# EAGLE design joysticks_right (EAGLE 6.4)
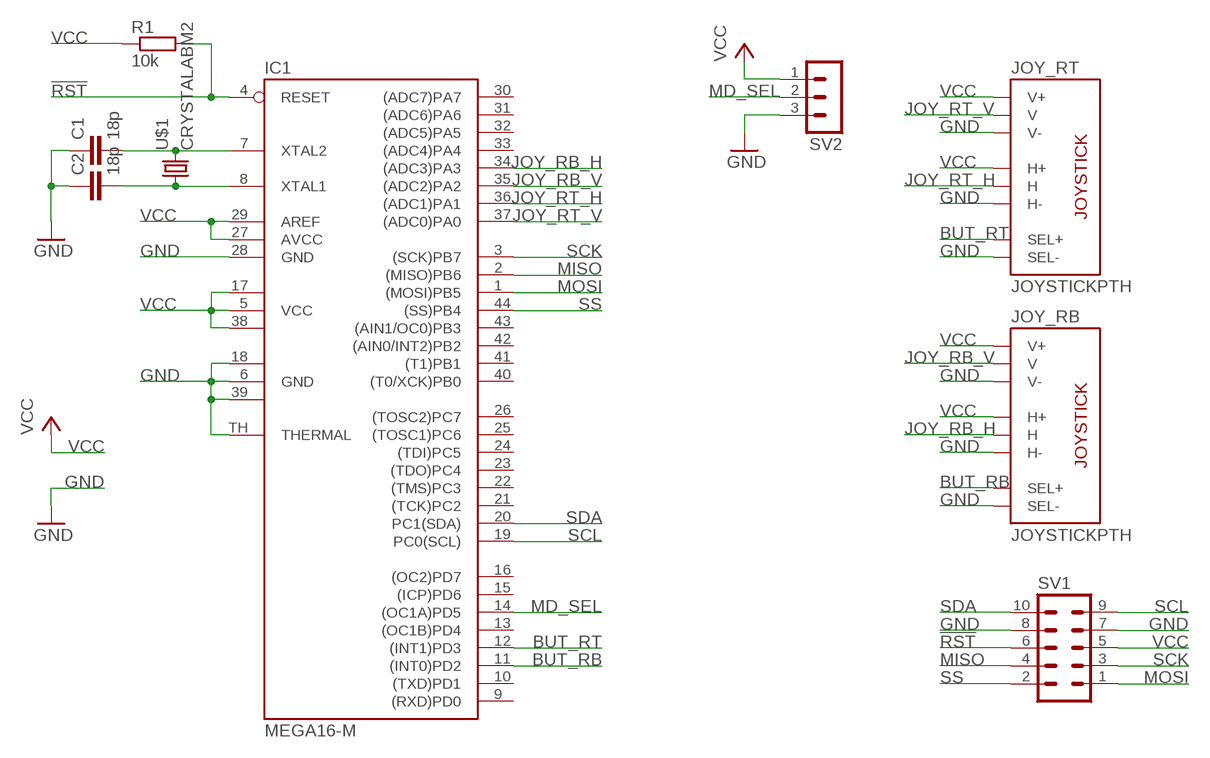
[diagram p0: schematic, sheet 1]

## Parts
C1  18p  C-EUC0603  [C0603]
C2  18p  C-EUC0603  [C0603]
IC1  MEGA16-M  [MLF44-TH]
JOY_RB  JOYSTICKPTH  [JOYSTICK]
JOY_RT  JOYSTICKPTH  [JOYSTICK]
R1  10k  R-EU_R0603  [R0603]
SV1  MA05-2  [MA05-2]
SV2  MA03-1  [MA03-1]
U$1  CRYSTALABM2  [ABM2]

## Nets
!RST: IC1.4(RESET) R1.2 SV1.6
BUT_RB: IC1.11((INT0)PD2) JOY_RB.B1A(SEL+)
BUT_RT: IC1.12((INT1)PD3) JOY_RT.B1A(SEL+)
GND: C1.1 C2.1 IC1.6(GND) IC1.18(GND1) IC1.28(GND) IC1.39(GND2) IC1.TH(THERMAL) JOY_RB.B2A(SEL-) JOY_RB.H3(H-) JOY_RB.V3(V-) JOY_RT.B2A(SEL-) JOY_RT.H3(H-) JOY_RT.V3(V-) SV1.7 SV1.8 SV2.3
JOY_RB_H: IC1.34((ADC3)PA3) JOY_RB.H2(H)
JOY_RB_V: IC1.35((ADC2)PA2) JOY_RB.V2(V)
JOY_RT_H: IC1.36((ADC1)PA1) JOY_RT.H2(H)
JOY_RT_V: IC1.37((ADC0)PA0) JOY_RT.V2(V)
MD_SEL: IC1.14((OC1A)PD5) SV2.2
MISO: IC1.2((MISO)PB6) SV1.4
MOSI: IC1.1((MOSI)PB5) SV1.1
N$1: C1.2 IC1.7(XTAL2) U$1.P$2
N$2: C2.2 IC1.8(XTAL1) U$1.P$1
SCK: IC1.3((SCK)PB7) SV1.3
SCL: IC1.19(PC0(SCL)) SV1.9
SDA: IC1.20(PC1(SDA)) SV1.10
SS: IC1.44((SS)PB4) SV1.2
VCC: IC1.5(VCC) IC1.17(VCC1) IC1.27(AVCC) IC1.29(AREF) IC1.38(VCC2) JOY_RB.H1(H+) JOY_RB.V1(V+) JOY_RT.H1(H+) JOY_RT.V1(V+) R1.1 SV1.5 SV2.1
Unconnected: IC1.9((RXD)PD0) IC1.10((TXD)PD1) IC1.13((OC1B)PD4) IC1.15((ICP)PD6) IC1.16((OC2)PD7) IC1.21((TCK)PC2) IC1.22((TMS)PC3) IC1.23((TDO)PC4) IC1.24((TDI)PC5) IC1.25((TOSC1)PC6) IC1.26((TOSC2)PC7) IC1.30((ADC7)PA7) IC1.31((ADC6)PA6) IC1.32((ADC5)PA5) IC1.33((ADC4)PA4) IC1.40((T0/XCK)PB0) IC1.41((T1)PB1) IC1.42((AIN0/INT2)PB2) IC1.43((AIN1/OC0)PB3)

## Library data of the parts
C1 C2 = rcl:C-EU: CAPACITOR, European symbol
IC1 = atmel:MEGA16-M: MICROCONTROLLER 16 Kbytes FLASH 1 kbytes SRAM 512 bytes EEPROM USART 8-channel 10 bit ADC Source: avr.lbr; MPN: ATMEGA16-16MU; OC_FARNELL: 1455097; OC_NEWARK: 58M3723
JOY_RB JOY_RT = SparkFun-Electromechanical:JOYSTICK: Thumb Joystick Joystick commonly found in PS2 controllers. Two pots and a select switch. Footprint proven. Spark Fun Electronics SKU : COM-09032
R1 = rcl:R-EU_: RESISTOR, European symbol
SV1 = con-lstb:MA05-2: PIN HEADER; OC_FARNELL: unknown; OC_NEWARK: unknown
SV2 = con-lstb:MA03-1: PIN HEADER; OC_FARNELL: unknown; OC_NEWARK: unknown
U$1 = jocki:CRYSTAL

## Board
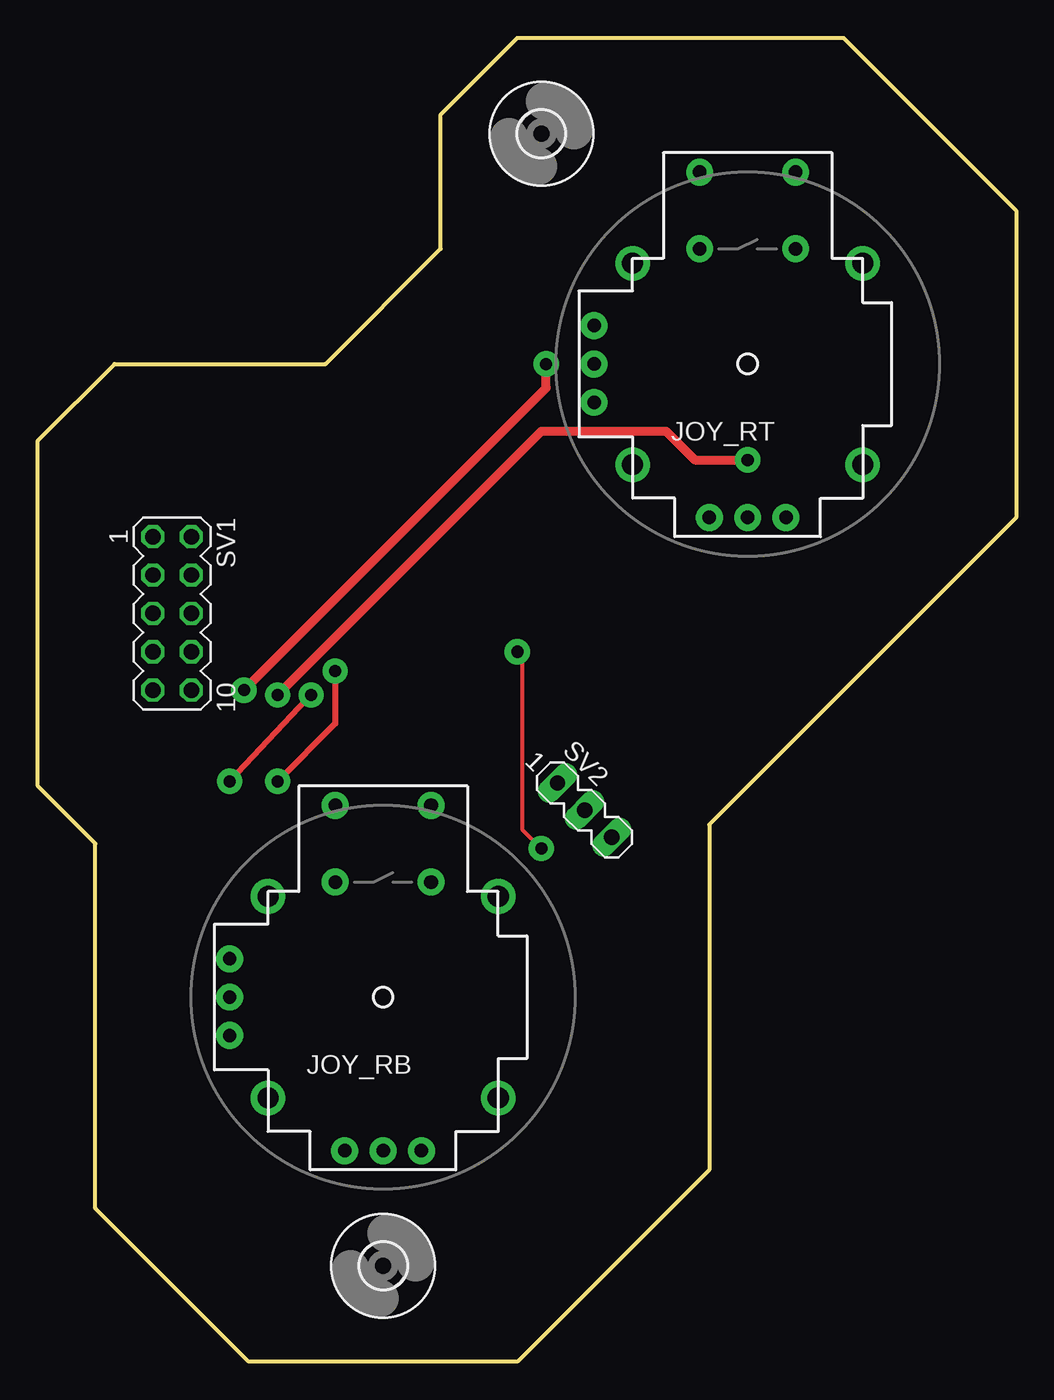
[diagram p1: board, top side]
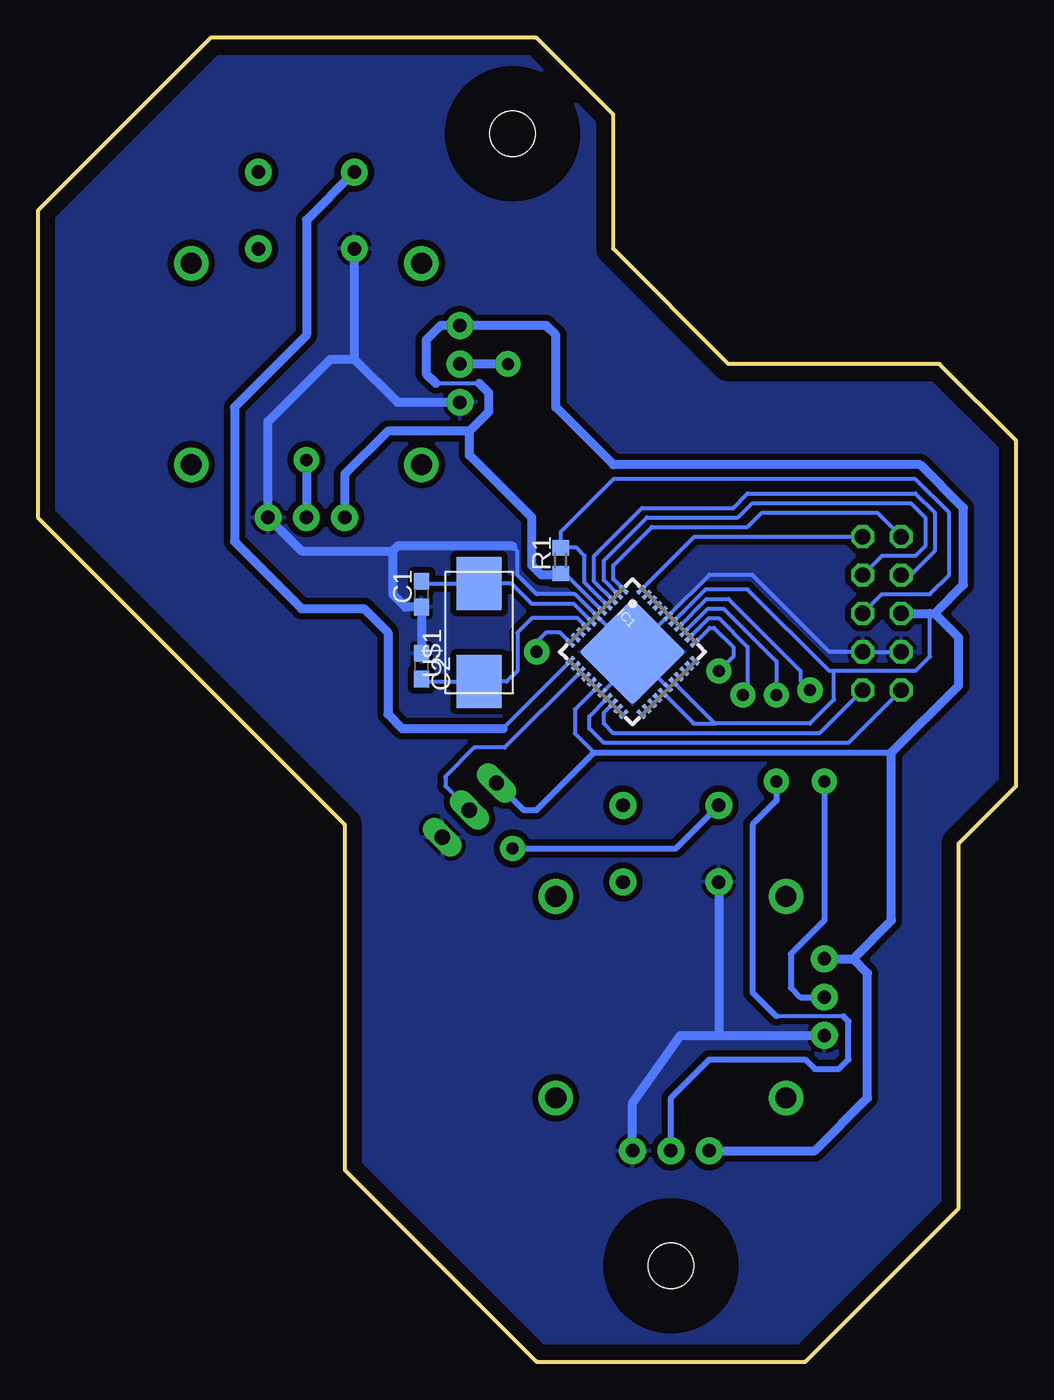
[diagram p2: board, bottom side, seen from below]

Size 64.77 x 87.63 mm. Coordinates in mm from the lower left corner, seen from the top.
Outline: 53.34,87.63 64.77,76.2 64.77,55.88 44.45,35.56 44.45,12.7 31.75,0 13.97,0 3.81,10.16 3.81,34.29 0,38.1 0,60.96 5.08,66.04 19.05,66.04 26.67,73.66 26.67,82.55 31.75,87.63 53.34,87.63
Copper layers (1*16): Top 0.035mm / dielectric 1.5mm / Bottom 0.035mm
Design rules "default": minimum track width 10mil, minimum drill 24mil, track to track 8mil, track to pad 8mil, pad to pad 8mil, via to via 8mil, smd to smd 8mil, copper to edge 40mil, drill to drill 8mil, minimum pad ring 10mil, minimum via ring 8mil, stop-mask expansion 4mil, vias tented up to drill 0mil, thermal gap 10mil

### Footprints (pad centres in the part's own frame; a part is rotated, then mirrored left to right if it is on the bottom)
C0603 = smd 1.1 x 1: 1 -0.85,0; 2 0.85,0
MLF44-TH = smd 0.7 x 0.3: 1 -3.325,2.5; 2 -3.325,2; 3 -3.325,1.5; 4 -3.325,1; 5 -3.325,0.5; 6 -3.325,0; 7 -3.325,-0.5; 8 -3.325,-1; 9 -3.325,-1.5; 10 -3.325,-2; 11 -3.325,-2.5; 23 3.325,-2.5; 24 3.325,-2; 25 3.325,-1.5; 26 3.325,-1; 27 3.325,-0.5; 28 3.325,0; 29 3.325,0.5; 30 3.325,1; 31 3.325,1.5; 32 3.325,2; 33 3.325,2.5 | smd 0.3 x 0.7: 12 -2.5,-3.325; 13 -2,-3.325; 14 -1.5,-3.325; 15 -1,-3.325; 16 -0.5,-3.325; 17 0,-3.325; 18 0.5,-3.325; 19 1,-3.325; 20 1.5,-3.325; 21 2,-3.325; 22 2.5,-3.325; 34 2.5,3.325; 35 2,3.325; 36 1.5,3.325; 37 1,3.325; 38 0.5,3.325; 39 0,3.325; 40 -0.5,3.325; 41 -1,3.325; 42 -1.5,3.325; 43 -2,3.325; 44 -2.5,3.325 | smd 5 x 5: TH 0,0
JOYSTICK = drill 0.9 pad 1.778: B1A -3.175,12.7; B1B 3.175,12.7; B2A -3.175,7.62; B2B 3.175,7.62 | drill 0.889 pad 1.778: H1 -2.54,-10.16; H2 0,-10.16; H3 2.54,-10.16; V1 -10.16,2.54; V2 -10.16,0; V3 -10.16,-2.54 | drill 1.397 pad 2.286: MOUNT1 -7.62,6.668; MOUNT2 -7.62,-6.668; MOUNT3 7.62,-6.668; MOUNT4 7.62,6.668
R0603 = smd 1 x 1.1: 1 -0.85,0; 2 0.85,0
MA05-2 = drill 1.016 octagon: 1 -5.08,-1.27; 2 -5.08,1.27; 3 -2.54,-1.27; 4 -2.54,1.27; 5 0,-1.27; 6 0,1.27; 7 2.54,-1.27; 8 2.54,1.27; 9 5.08,-1.27; 10 5.08,1.27
MA03-1 = drill 1.016 long: 1 -2.54,0; 2 0,0; 3 2.54,0
ABM2 = smd 3.5 x 3: P$1 -3.25,0; P$2 3.25,0
3,0 = hole 3: 0,0

### Placement (x,y rotation side)
C1  39.37,50.8 90 bottom
C2  39.37,46.04 270 bottom
IC1  25.4,46.99 315 bottom
JOY_RB  22.86,24.13 0 top
JOY_RT  46.99,66.04 0 top
R1  30.16,53.02 90 bottom
SV1  8.89,49.53 270 top
SV2  36.2,36.51 315 top
U$1  35.56,48.26 90 bottom
U$2  [3,0]  22.86,6.35 0 top
U$3  [3,0]  33.34,81.28 0 top

### Tracks (layer width: path | path; a pad name or v marks a point on that pad's centre or on a via)
!RST
  Bottom 0.254: IC1.4 28.57,51.58 28.57,53.34 29.11,53.87 R1.2 30.16,54.93 26.67,58.42 6.67,58.42 4.45,56.2 4.45,52.07 5.71,50.8 8.89,50.8 SV1.6
BUT_RB  (via drill 0.8 pad 1.68)
  Top 0.254: v31.75,46.99 32.07,46.67 32.07,35.24 v33.34,33.97
  Bottom 0.254: IC1.11 30.21,48.26 31.11,48.26 31.75,47.62 v31.75,46.99
  Bottom 0.406: v33.34,33.97 22.54,33.97 JOY_RB.B1A
BUT_RT
  Bottom 0.254: 33.97,41.91 29.52,46.36 IC1.12
  Bottom 0.61: JOY_RT.B1A 46.99,75.56 46.99,67.95 51.75,63.18 51.75,54.29 47.31,49.85 43.18,49.85 41.59,48.26 41.59,42.86 40.64,41.91 33.97,41.91
GND
  Bottom 0.254: IC1.6 29.21,50.8 31.75,50.8 33.02,52.07 33.02,53.66 33.34,53.98 | SV1.7 SV1.8 12.38,46.99 17.46,52.07 20.32,52.07 IC1.39 IC1.TH | IC1.6 | IC1.6 IC1.TH | IC1.28 | IC1.28 IC1.TH | IC1.18 25.4,46.28 IC1.TH
  Bottom 0.61: C2.1 C1.1 40.43,49.95 41.28,50.8 41.28,53.66 | 33.34,53.98 40.96,53.98 41.28,53.66 | JOY_RT.B2A 43.82,66.36 | 43.82,66.36 40.96,63.5 JOY_RT.V3 | 43.82,66.36 45.4,66.36 49.53,62.23 JOY_RT.H3 47.31,53.66 41.28,53.66 | JOY_RB.H3 25.4,17.14 22.22,21.59 19.68,21.59 | 19.68,21.59 JOY_RB.V3 | JOY_RB.B2A 19.68,21.59
  pour Bottom (isolate 0.406): 0,60.96 0,38.1 3.81,34.29 3.81,10.16 13.97,0 31.75,0 44.45,12.7 44.45,35.56 64.77,55.88 64.77,76.2 53.34,87.63 31.75,87.63 26.67,82.55 26.67,73.66 19.05,66.04 5.08,66.04
JOY_RB_H  (via drill 0.8 pad 1.68)
  Top 0.406: v19.68,45.72 19.68,42.23 v15.88,38.42
  Bottom 0.254: IC1.34 20.28,48.58 20,48.58 18.73,47.31 18.73,46.67 v19.68,45.72 | 11.43,22.86 15.88,22.86
  Bottom 0.406: JOY_RB.H2 22.86,17.46 20.32,20 13.97,20 13.33,19.37 11.75,19.37 11.11,20 11.11,22.54 11.43,22.86 | v15.88,38.42 15.88,37.15 17.46,35.56 17.46,24.45 15.88,22.86
JOY_RB_V  (via drill 0.8 pad 1.68)
  Top 0.254: v18.1,44.13 17.78,43.82
  Top 0.406: 17.78,43.82 v12.7,38.42
  Bottom 0.254: IC1.35 20.35,49.21 19.68,49.21 17.78,47.31 17.78,44.45 v18.1,44.13
  Bottom 0.406: JOY_RB.V2 14.29,24.13 14.92,24.76 14.92,26.99 12.7,29.21 v12.7,38.42
JOY_RT_H  (via drill 0.8 pad 1.68)
  Top 0.61: v15.88,44.13 33.34,61.59 41.59,61.59 43.5,59.69 v46.99,59.69
  Bottom 0.254: IC1.36 20.42,49.85 19.37,49.85 15.88,46.36 v15.88,44.13
  Bottom 0.61: v46.99,59.69 JOY_RT.H2
JOY_RT_V  (via drill 0.8 pad 1.68)
  Top 0.61: v13.65,44.45 33.66,64.45 v33.66,66.04
  Bottom 0.254: IC1.37 20.49,50.48 19.05,50.48 14.29,45.72 14.29,45.09 v13.65,44.45
  Bottom 0.61: v33.66,66.04 JOY_RT.V2
MD_SEL
  Bottom 0.254: IC1.14 33.87,40.64 35.88,40.64 37.78,38.73 37.78,38.1 SV2.2
MISO
  Bottom 0.254: IC1.2 27.3,51.72 27.3,53.02 24.45,55.88 18.41,55.88 17.46,56.83 6.98,56.83 6.03,55.88 6.03,53.98 6.67,53.34 8.89,53.34 SV1.4
MOSI
  Bottom 0.254: IC1.1 26.67,51.8 26.67,52.71 24.13,55.25 17.78,55.25 16.83,56.2 9.21,56.2 SV1.1
N$1
  Bottom 0.254: C1.2 39.23,51.51 U$1.P$2 33.41,51.51 32.07,50.16 29.28,50.16 IC1.7
N$2
  Bottom 0.254: C2.2 39.19,45.01 U$1.P$1 33.73,45.01 33.02,45.72 33.02,48.26 32.07,49.21 29.04,49.21 IC1.8
SCK
  Bottom 0.254: IC1.3 27.94,51.65 27.94,53.34 24.77,56.52 18.73,56.52 17.78,57.47 6.67,57.47 5.4,56.2 5.4,53.66 6.98,52.07 SV1.3
SCL
  Bottom 0.254: SV1.9 11.11,40.96 27.3,40.96 28.26,41.91 28.26,42.72 IC1.19
SDA
  Bottom 0.254: SV1.10 13.02,41.59 26.67,41.59 27.3,42.23 27.3,42.96 IC1.20
SS
  Bottom 0.254: IC1.44 21.32,54.61 SV1.2
VCC
  Bottom 0.254: IC1.5 29.88,52.17 R1.1 30.27,52.07 | 12.06,45.72 6.67,45.72 5.71,46.67 5.71,49.53 | 12.06,45.72 12.38,45.72 17.78,51.12 20.57,51.12 IC1.38 | 38.42,64.77 35.56,64.77 | 12.06,45.72 12.06,43.82 13.65,42.23 19.93,42.23 | IC1.17 29.21,43.18 29.21,41.59 27.94,40.32 | 19.93,42.23 IC1.29 | IC1.27 21.34,42.23 19.93,42.23
  Bottom 0.406: 8.26,40.32 27.94,40.32 31.75,36.51 32.6,36.51 SV2.1
  Bottom 0.61: 38.42,64.77 39.05,65.41 39.05,67.63 38.1,68.58 JOY_RT.V1 31.11,68.58 30.48,67.95 30.48,63.18 26.67,59.37 6.35,59.37 3.49,56.52 3.49,51.44 5.4,49.53 | 35.56,64.77 34.93,64.14 34.93,62.87 36.2,61.59 | 36.2,61.59 41.59,61.59 44.45,58.74 JOY_RT.H1 | 30.27,52.07 31.43,52.07 32.07,52.71 32.07,55.88 36.2,60.01 36.2,61.59 | SV1.5 5.71,49.53 5.4,49.53 | JOY_RB.H1 13.33,13.97 9.84,17.46 9.84,25.72 10.79,26.67 | JOY_RB.V1 10.79,26.67 | 10.79,26.67 8.26,29.21 8.26,40.32 3.81,44.77 3.81,47.94 5.4,49.53